# Altium project PCB_Project.PrjPcb
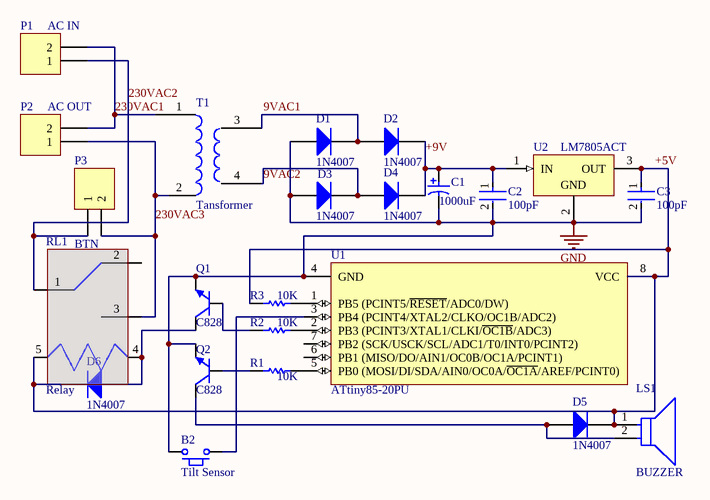
[diagram p0: Sheet1.SchDoc]
1 sheet, 23 parts. Net scope: global (net labels, ports and power ports of the same name join across sheets).
Board file: PCB1.PcbDoc

## Sheet Sheet1.SchDoc: Automatic Iron Controller
size Letter; DrawnBy: Chamod Abeywickrama; SheetNumber: 1; SheetTotal: 1

### Parts
B2  Tilt Sensor  [PUSH_BTN]
C1  Capacitance: 1000uF  [CAPPR65-500-2000X1000X2200]  (hidden comment: ECA1EM102)
C2  Capacitance: 100pF  [FP-RCE0DB-MFG]  (hidden comment: RCE5C1H101J0DBH03A)
C3  Capacitance: 100pF  [FP-RCE0DB-MFG]  (hidden comment: RCE5C1H101J0DBH03A)
D1  1N4007  [1N4007]
D2  1N4007  [1N4007]
D3  1N4007  [1N4007]
D4  1N4007  [1N4007]
D5  1N4007  [1N4007]
D6  1N4007  [1N4007]
LS1  BUZZER  [FP-MCKPX-G1203A-K4056-MFG]
P1  AC IN  [H2_PWR_AC]
P2  AC OUT  [H2_PWR_AC]
P3  BTN  [H2_PWR_AC]
Q1  C828  [TO-92_ONS]
Q2  C828  [TO-92_ONS]
R1  10K  [RES]
R2  10K  [RES]
R3  10K  [RES]
RL1  Relay  [Relay]
T1  Tansformer  [TRANSFORMER]
U1  ATtiny85-20PU  [8P3]
U2  LM7805ACT  [FAIR-TO-220-3]

### Nets
GND: B2.1 C1.2 C2.2 C3.2 D1.1(A) D3.1(A) Q1.1(E) Q2.1(E) U1.4(GND) U2.2(GND)
9VAC1: D1.2(K) D2.1(A) T1.3(DC1)
9VAC2: D3.2(K) D4.1(A) T1.4(DC2)
230VAC1: P1.2 P2.2 T1.1(AC1)
230VAC2: P1.1 P3.1 RL1.1
230VAC3: P2.1 P3.2 RL1.3 T1.2(AC2)
+5V: C3.1 D5.2(K) D6.2(K) LS1.1(C) R3.1 RL1.5 U1.8(VCC) U2.3(OUT)
+9V: C1.1 C2.1 D2.2(K) D4.2(K) U2.1(IN)
NetB2_2: B2.2 U1.3(PB4_(PCINT4/XTAL2/CLKO/OC1B/ADC2))
NetD5_1: D5.1(A) LS1.2(A) Q2.2(C)
NetD6_1: D6.1(A) Q1.2(C) RL1.4
NetQ1_3: Q1.3(B) R2.1
NetQ2_3: Q2.3(B) R1.1
NetR1_2: R1.2 U1.5(PB0_(MOSI/DI/SDA/AIN0/OC0A/~{OC1A}/AREF/PCINT0))
NetR2_2: R2.2 U1.2(PB3_(PCINT3/XTAL1/CLKI/~{OC1B}/ADC3))
NetR3_2: R3.2 U1.1(PB5_(PCINT5/~{RESET}/ADC0/DW))

Not connected (* = marked no-connect by the designer): RL1 2; U1 6(PB1_(MISO/DO/AIN1/OC0B/OC1A/PCINT1)) 7(PB2_(SCK/USCK/SCL/ADC1/T0/INT0/PCINT2))

### Library data of the parts
B2 = Push Button
C1 = CMP-1665-00045-2: Aluminum Electrolytic Capacitor, 1000 uF, +/- 20%, 25 V, -40 to 85 degC, 2-Pin THD, RoHS, Bulk; Manufacturer: Panasonic; Dielectric Material: Aluminium; Leakage Current: 3uA; Voltage Rating (DC): 25V; Lead/Base Style: Straight; Ripple Current: 850mA; Polarity: Polar; Dissipation Factor: 0.16%; Life (Hours): 2000Hour; Lead Diameter: 0.6mm; Height: 20mm; Min Operating Temperature: -40degC; Packaging: Bulk; Diameter: 10mm; Datasheet URL: https://industrial.panasonic.com/cdbs/www-data/pdf/RDF0000/ABA0000C1218.pdf; Package Reference: CAPPR65-500-2000X1000X2200; Lead Pitch: 5mm; Tolerance: 20%; Length: 20mm; Max Operating Temperature: 85degC; Contact Plating: Tin; Mount: ThroughHole; Manufacturer URL: http://www.panasonic.com/; Voltage Rating: 25V; Package Quantity: 200; Lead Free: LeadFree; Datasheet Version: Rev. 05, 10/2016; Width: 0inch; Package Description: 2-Pin Radial Lead, Dia 10 mm, Height 22 mm; Voltage: 25V; Case/Package: Radial; RoHSCompliant: true; REACH SVHC: NoSVHC; Termination: Radial; Height - Seated (Max): 0.866inch; Radiation Hardening: No
C2 C3 = CMP-06035-041850-1: Cap Ceramic 100pF 50V C0G ±5% Radial 2.5mm +125°C Ammo Pack; Lead/Base Style: Straight; Lead Diameter: 0.5mm; Height: 3.5mm; Ratings: AEC-Q200; Case/Package: Radial; Termination: Radial; Height - Seated (Max): 0.138inch; Package Quantity: 2000; Tolerance: 5%; Min Operating Temperature: -55°C; Mount: Through Hole; Packaging: Tape and Reel; Dielectric: C0G; Voltage Rating: 50V; Max Operating Temperature: 125°C; Resistor Type: Ceramic; Width: 0.098inch; Length: 0.142inch; Lead Pitch: 0.098inch; Voltage Rating (DC): 50V
D1-D6 = Diode 1N4007: 1 Amp General Purpose Rectifier; Published: 8-Jun-2000; LatestRevisionDate: 17-Jul-2002; LatestRevisionNote: Re-released for DXP Platform.; DatasheetVersion: 1998; PackageVersion: Aug-1999; PackageReference: DO-41; Publisher: Altium Limited; PackageDescription: Diode, Axial; Body 5.2 x 2.7 mm (LxDia. max), Lead Dia. 0.86 mm (max); Code_JEDEC: DO-204-AL; ComponentLink1Description: Manufacturer Link; ComponentLink1URL: http://www.fairchildsemi.com/; ComponentLink2Description: Datasheet; ComponentLink2URL: http://www.fairchildsemi.com/ds/1N%2F1N4001.pdf
LS1 = CMP-12433-000001-1: Manufacturer Part Number: MCKPX-G1203A-K4056; Manufacturer: Multicomp Pro; Operating Supply Voltage: 3V; Current: 30mA; Frequency: 2300Hz; Max Supply Voltage: 5V; Min Supply Voltage: 2V; Standoff Height: 0.5mm; ComponentLink2Description: Datasheet; ComponentLink2URL: http://www.farnell.com/datasheets/1498149.pdf?_ga=2.17855225.1157923166.1572356775-536200964.1569240579; Temperature Range High: +70°C; Device Class L2: Audio Products; Temperature Range Low: -20°C; Package: 0; Temperature: -20°C to +70°C; Category: Speak; Octopart: https://octopart.com/mckpx-g1203a-k4056-multicomp-12157154; RoHS: TRUE; Lead Free: Yes; Height: 9.5mm; Device Class L1: Electromechanical; Automotive: No; Device Class L3: Buzzers
P1-P3 = Header 2: Header, 2-Pin; LatestRevisionDate: 17-Jul-2002; LatestRevisionNote: Re-released for DXP Platform.; Publisher: Altium Limited
Q1 Q2 = C828: NPN General Purpose Transistor; Published: 8-Jun-2000; LatestRevisionDate: 15-Jan-2003; LatestRevisionNote: PCB Footprint 'BCY-W3/D4.7' replaced; DatasheetVersion: 1997; PackageVersion: Sep-1998; PackageReference: TO-92A; Publisher: Altium Limited; PackageDescription: TO, Flat Index; 3 In-Line, Axial Leads; Body Dia. 4.5mm; Leads 0.51 x 0.48 mm (max); ComponentLink1Description: Manufacturer Link; ComponentLink1URL: http://www.fairchildsemi.com/; ComponentLink2Description: Datasheet; ComponentLink2URL: http://www.fairchildsemi.com/ds/2N%2F2N3904.pdf
R1-R3 = Res1: Resistor; Published: 8-Jun-2000; LatestRevisionDate: 17-Jul-2002; LatestRevisionNote: Re-released for DXP Platform.; PackageReference: AXIAL-0.3; Publisher: Altium Limited; PackageDescription: Axial Device, Thru-Hole; 2 Leads; 0.3 in Pin Spacing; Value: 10K
U1 = CMP-0093-00032-2: 8-bit AVR Microcontroller, 20MHz, 2.7-5.5V, 8K Flash, 512 Bytes EEPROM, 512 Bytes SRAM, Industrial Grade (-40°C to 85°C), 8-Lead PDIP, Pb-Free; PackageVersion: revB, Jan-2002; ComponentLink2URL: http://www.atmel.com/dyn/resources/prod_documents/doc2586.pdf; PackageReference: 8P3; ComponentLink2Description: ATtiny25/45/85 Datasheet; ComponentLink3Description: ATtiny25/45/85 Summary; ComponentLink3URL: http://www.atmel.com/dyn/resources/prod_documents/2586S.pdf; RevisionNote: DatasheetVersion updated. URLs added.; DatasheetVersion: revN, Apr-2011; ComponentLink1Description: Manufacturer URL; Code_JEDEC: MS-001-BA; ComponentLink1URL: http://www.atmel.com/; PackageDescription: 8-Lead, 0.300" Wide Body, Plastic Dual In-Line Package (PDIP)
U2 = CMP-2000-04937-1: Positive Voltage Regulator, 5 V, 1 A, 0 to 125 degC, 3-Pin TO-220, RoHS, Tube; Manufacturer: Fairchild; Number of Outputs: 1; Typical Dropout Voltage @ Current: 2V@1A; Output Type: Fixed; Output Voltage: 5V; Quiescent Current: 6mA; Dropout Voltage Measurement Current: 1A; Line Regulation: 50mV; Maximum Input Voltage: 35V; Regulator Function: Linear; Load Regulation: 100mV; Package Type: TO-220; Mounting Type: ThroughHole; Height: 16.51mm; Maximum Operating Temperature: +125degC; Datasheet Version: Rev. 1.0.1, 05/2006; Package Reference: TO-220; Minimum Operating Temperature: 0degC; Manufacturer URL: https://www.fairchildsemi.com/; Package URL: https://www.fairchildsemi.com/package-drawings/TO/TO220B03.pdf; Length: 10.67mm; Series: LM78xx; Dimensions: 10.67x4.83x16.51mm; Polarity: Positive; Maximum Output Current: 1A; Pin Count: 3; Width: 4.83mm; Package Description: 3-Pin Through Hole Device, Body 10 x 4.5 mm, Pitch 2.54 mm; Datasheet URL: https://datasheet.ciiva.com/5816/1359194-5816420.pdf